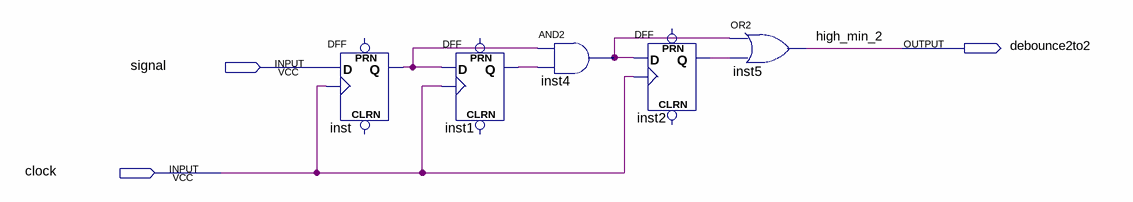
[diagram p0: schematic sheet]
// Quartus schematic debounce2to2.bdf as structural Verilog: 5 symbols, 3 pins
module debounce2to2 (
  input  signal,
  input  clock,
  output debounce2to2
);

  wire inst1_q, inst2_q, inst4_out, inst_q;

  DFF inst (.CLK(clock), .D(signal), .Q(inst_q));  // open: CLRN, PRN
  DFF inst1 (.CLK(clock), .D(inst_q), .Q(inst1_q));  // open: CLRN, PRN
  and inst4 (inst4_out, inst_q, inst1_q);
  DFF inst2 (.CLK(clock), .D(inst4_out), .Q(inst2_q));  // open: CLRN, PRN
  or inst5 (debounce2to2, inst4_out, inst2_q);

  // Other names for the same wires on the sheet: high_min_2 = debounce2to2
endmodule
